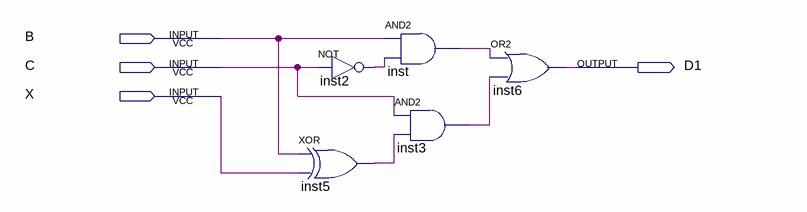
[diagram p0: schematic sheet]
// Quartus schematic F1.bdf as structural Verilog: 5 symbols, 4 pins
module F1 (
  input  B,
  input  C,
  input  X,
  output D1
);

  wire inst2_out, inst3_out, inst5_out, inst_out;

  not inst2 (inst2_out, C);
  xor inst5 (inst5_out, B, X);
  and inst (inst_out, B, inst2_out);
  and inst3 (inst3_out, C, inst5_out);
  or inst6 (D1, inst_out, inst3_out);
endmodule
